# Altium schematic sheet ClockBase.SchDoc
size A4; SheetNumber: 1; SheetTotal: 1
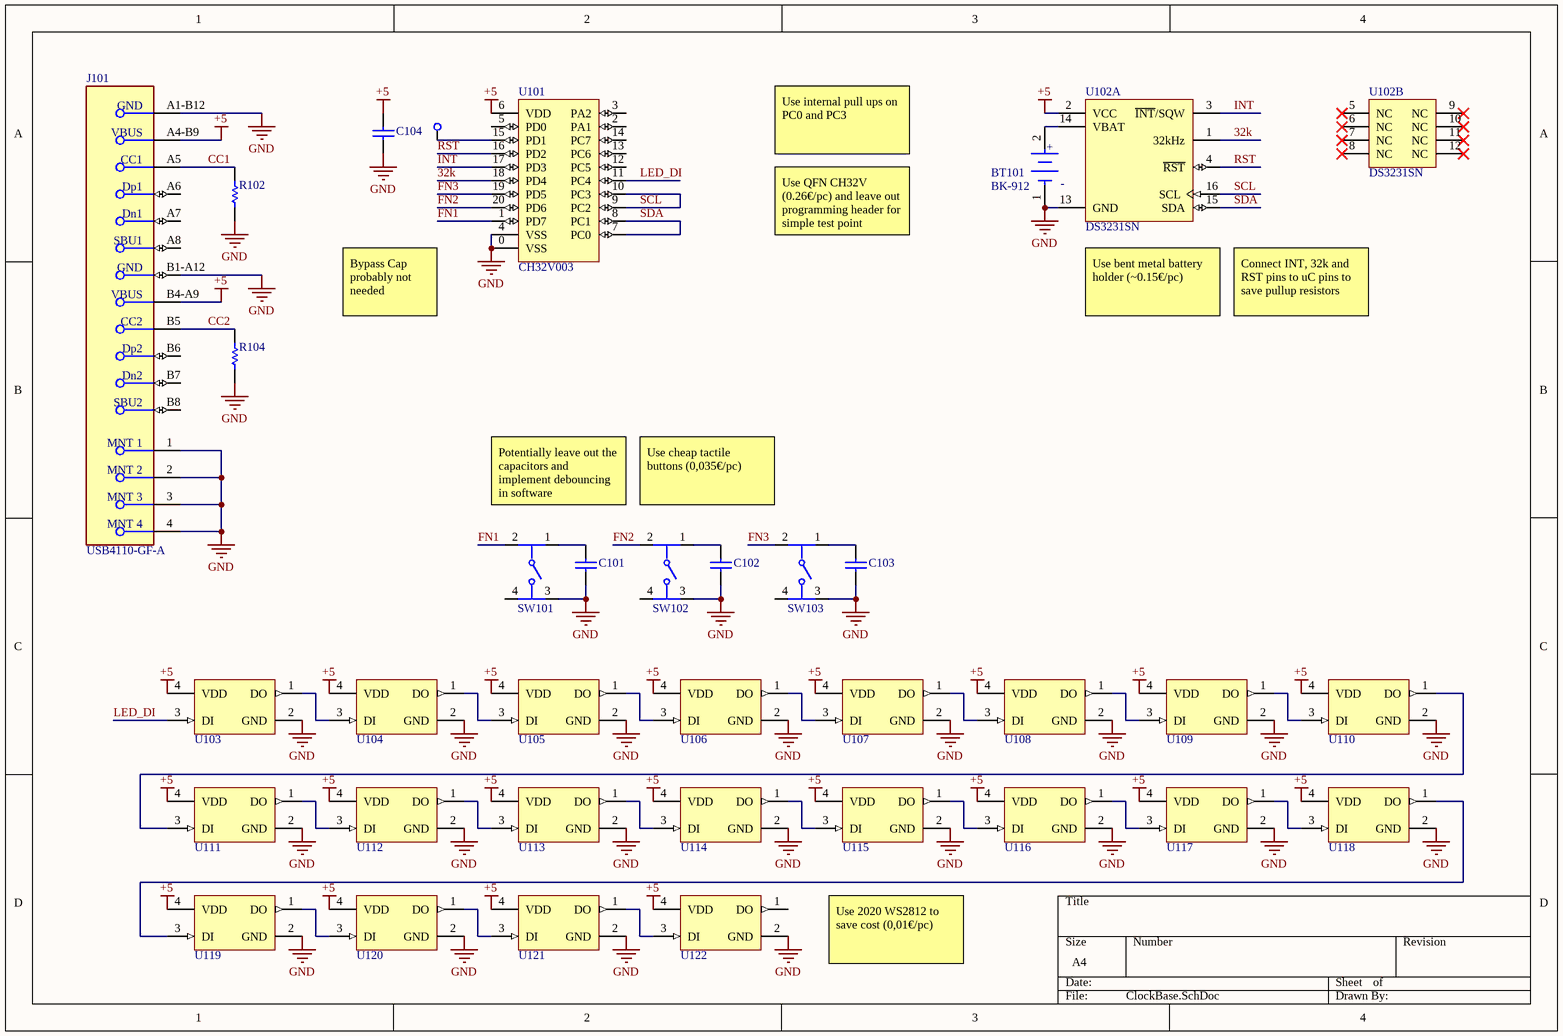
[diagram p0: ClockBase.SchDoc]

## Parts
BT101  BK-912  [FP-BK-912-MFG]
C101  Capacitor  [CAPC1608X09N]  (value not drawn)
C102  Capacitor  [CAPC1608X09N]  (value not drawn)
C103  Capacitor  [CAPC1608X09N]  (value not drawn)
C104  Capacitor  [CAPC1608X09N]  (value not drawn)
J101  USB4110-GF-A  [FP-USB4110-GF-A-MFG]
R102  Resistor  [RESC1608X06N]  (value not drawn)
R104  Resistor  [RESC1608X06N]  (value not drawn)
SW101  PTS526SK15SMTR2LFS  [FP-PTS526SK15SMTR2LFS-MFG]  (value not drawn)
SW102  PTS526SK15SMTR2LFS  [FP-PTS526SK15SMTR2LFS-MFG]  (value not drawn)
SW103  PTS526SK15SMTR2LFS  [FP-PTS526SK15SMTR2LFS-MFG]  (value not drawn)
TP101  TestPoint  [TestPoint]  (value not drawn)
U101  CH32V003  [QFN40P300X300X75_HS-21N]
U102  DS3231SN  [SOP127P1030X265-16N]  (parts A,B of 2)
U103  NOT COMPATIBLE WITH WS2812B  [LED_WS2812-2020]  (value not drawn)
U104  NOT COMPATIBLE WITH WS2812B  [LED_WS2812-2020]  (value not drawn)
U105  NOT COMPATIBLE WITH WS2812B  [LED_WS2812-2020]  (value not drawn)
U106  NOT COMPATIBLE WITH WS2812B  [LED_WS2812-2020]  (value not drawn)
U107  NOT COMPATIBLE WITH WS2812B  [LED_WS2812-2020]  (value not drawn)
U108  NOT COMPATIBLE WITH WS2812B  [LED_WS2812-2020]  (value not drawn)
U109  NOT COMPATIBLE WITH WS2812B  [LED_WS2812-2020]  (value not drawn)
U110  NOT COMPATIBLE WITH WS2812B  [LED_WS2812-2020]  (value not drawn)
U111  NOT COMPATIBLE WITH WS2812B  [LED_WS2812-2020]  (value not drawn)
U112  NOT COMPATIBLE WITH WS2812B  [LED_WS2812-2020]  (value not drawn)
U113  NOT COMPATIBLE WITH WS2812B  [LED_WS2812-2020]  (value not drawn)
U114  NOT COMPATIBLE WITH WS2812B  [LED_WS2812-2020]  (value not drawn)
U115  NOT COMPATIBLE WITH WS2812B  [LED_WS2812-2020]  (value not drawn)
U116  NOT COMPATIBLE WITH WS2812B  [LED_WS2812-2020]  (value not drawn)
U117  NOT COMPATIBLE WITH WS2812B  [LED_WS2812-2020]  (value not drawn)
U118  NOT COMPATIBLE WITH WS2812B  [LED_WS2812-2020]  (value not drawn)
U119  NOT COMPATIBLE WITH WS2812B  [LED_WS2812-2020]  (value not drawn)
U120  NOT COMPATIBLE WITH WS2812B  [LED_WS2812-2020]  (value not drawn)
U121  NOT COMPATIBLE WITH WS2812B  [LED_WS2812-2020]  (value not drawn)
U122  NOT COMPATIBLE WITH WS2812B  [LED_WS2812-2020]  (value not drawn)

## Nets
+5: C104.2 J101.A4-B9(VBUS) J101.B4-A9(VBUS) U101.6(VDD) U102.2(VCC) U103.4(VDD) U104.4(VDD) U105.4(VDD) U106.4(VDD) U107.4(VDD) U108.4(VDD) U109.4(VDD) U110.4(VDD) U111.4(VDD) U112.4(VDD) U113.4(VDD) U114.4(VDD) U115.4(VDD) U116.4(VDD) U117.4(VDD) U118.4(VDD) U119.4(VDD) U120.4(VDD) U121.4(VDD) U122.4(VDD)
GND: BT101.1(C) C101.1 C102.1 C103.1 C104.1 J101.1(MNT_1) J101.2(MNT_2) J101.3(MNT_3) J101.4(MNT_4) J101.A1-B12(GND) J101.B1-A12(GND) R102.1 R104.1 SW101.3 SW102.3 SW103.3 U101.0(VSS) U101.4(VSS) U102.13(GND) U103.2(GND) U104.2(GND) U105.2(GND) U106.2(GND) U107.2(GND) U108.2(GND) U109.2(GND) U110.2(GND) U111.2(GND) U112.2(GND) U113.2(GND) U114.2(GND) U115.2(GND) U116.2(GND) U117.2(GND) U118.2(GND) U119.2(GND) U120.2(GND) U121.2(GND) U122.2(GND)
32k: U101.18(PD4) U102.1(32kHz)
CC1: J101.A5(CC1) R102.2
CC2: J101.B5(CC2) R104.2
FN1: SW101.2 U101.1(PD7)
FN2: SW102.2 U101.20(PD6)
FN3: SW103.2 U101.19(PD5)
INT: U101.17(PD3) U102.3(~{INT}/SQW)
LED_DI: U101.11(PC4) U103.3(DI)
RST: U101.16(PD2) U102.4(~{RST})
SCL: U101.9(PC2) U101.10(PC3) U102.16(SCL)
SDA: U101.7(PC0) U101.8(PC1) U102.15(SDA)
NetBT101_2: BT101.2(A) U102.14(VBAT)
NetC101_2: C101.2 SW101.1
NetC102_2: C102.2 SW102.1
NetC103_2: C103.2 SW103.1
NetTP101_TP: TP101.TP U101.15(PD1)
NetU103_1: U103.1(DO) U104.3(DI)
NetU104_1: U104.1(DO) U105.3(DI)
NetU105_1: U105.1(DO) U106.3(DI)
NetU106_1: U106.1(DO) U107.3(DI)
NetU107_1: U107.1(DO) U108.3(DI)
NetU108_1: U108.1(DO) U109.3(DI)
NetU109_1: U109.1(DO) U110.3(DI)
NetU110_1: U110.1(DO) U111.3(DI)
NetU111_1: U111.1(DO) U112.3(DI)
NetU112_1: U112.1(DO) U113.3(DI)
NetU113_1: U113.1(DO) U114.3(DI)
NetU114_1: U114.1(DO) U115.3(DI)
NetU115_1: U115.1(DO) U116.3(DI)
NetU116_1: U116.1(DO) U117.3(DI)
NetU117_1: U117.1(DO) U118.3(DI)
NetU118_1: U118.1(DO) U119.3(DI)
NetU119_1: U119.1(DO) U120.3(DI)
NetU120_1: U120.1(DO) U121.3(DI)
NetU121_1: U121.1(DO) U122.3(DI)

Not connected (* = marked no-connect by the designer): J101 A6(Dp1) A7(Dn1) A8(SBU1) B6(Dp2) B7(Dn2) B8(SBU2); SW101 4; SW102 4; SW103 4; U101 2(PA1) 3(PA2) 5(PD0) 12(PC5) 13(PC6) 14(PC7); U102 5(NC)* 6(NC)* 7(NC)* 8(NC)* 9(NC)* 10(NC)* 11(NC)* 12(NC)*; U122 1(DO)

## Notes on the sheet
- Use internal pull ups on PC0 and PC3
- Use QFN CH32V (0.26€/pc) and leave out programming header for simple test point
- Bypass Cap probably not needed
- (near U102) Use bent metal battery holder (~0.15€/pc)
- Connect INT, 32k and RST pins to uC pins to save pullup resistors
- Potentially leave out the capacitors and implement debouncing in software
- Use cheap tactile buttons (0,035€/pc)
- Use 2020 WS2812 to save cost (0,01€/pc)
- (in symbol CMP-136216-000003-1) +; -

## Library data of the parts
BT101 = CMP-136216-000003-1: BATTERY RETAINER COIN 20MM SMD; Number of Cells: 1; Mount: Surface Mount; Termination: SMD/SMT; Package Quantity: 100; Case/Package: SMD/SMT
C101-C104 = C0603: Value: 1p; Voltage: *; Dielectric: *
J101 = CMP-245163-000002-1: CONN USB 2.0 TYPE-C R/A SMT; Manufacturer: GCT; Conn Orientation: Right Angle; Usb Standard: USB 2.0; Voltage Rating: 20V; Current Rating: 3/4.25/1.25/0.25A; Number Of Contacts: 16; Is Female: yes; Shielding: true; Standoff Height: 0.1mm; Octopart: https://octopart.com/usb4110-gf-a-gct-103941985; Temperature: -40°C to +85°C; RoHS: TRUE; Automotive: No; Contact Material: Gold,Nickel; Device Class L1: Connectors; Device Class L2: USB Connectors; Package: 0; Lead Free: Yes; ComponentLink2URL: https://gct.co/files/drawings/usb4110.pdf; Temperature Range High: +85°C; Temperature Range Low: -40°C; Height: 3.46mm; Manufacturer Part Number: USB4110-GF-A; ComponentLink2Description: Datasheet; Device Class L3: unset; Digikey Description: CONN USB 2.0 TYPE-C R/A SMT; Category: Conn
R102 R104 = R0603: Value: *
SW101-SW103 = CMP-10040-000013-1: TACT 5.2 X 5.2, 1.5 MM H, 260GF,; Manufacturer: C&K; Operating Force: 250gf; Throw Configuration: SPST-NO; Contact Current Rating: 50mA; Standoff Height: 0mm; Contact Resistance: 100mΩ; Voltage Rating Dc: 12V; Electromechanical Life: 200000Cycles; Device Class L3: Tactile Switches; Device Class L2: Switches; Temperature: -20°C to +70°C; Temperature Range Low: -20°C; Package: PTS526SK15SMTR2LFS; Temperature Range High: +70°C; ComponentLink2Description: Datasheet; Device Class L1: Electromechanical; Height: 1.65mm; Digikey Description: TACT 5.2 X 5.2, 1.5 MM H, 260GF,; Category: Switch; RoHS: TRUE; Automotive: No; Lead Free: Yes; Manufacturer Part Number: PTS526SK15SMTR2LFS; Octopart: https://octopart.com/pts526+sk15+smtr2+lfs-c%26k+components-100617999; ComponentLink2URL: https://www.ckswitches.com/media/2780/pts526.pdf
U101 = CH32V003F4U6: CH32V003 series is an industrial-grade general-purpose microcontroller designed based on QingKe RISC-V2A / core, which supports 48MHz system main frequency in the product function
U102 = DS3231SN: Extremely Accurate I2C-Integrated Real-Time Clock/TCXO/Crystal, 16-Pin SO, -40 to 85 degC, Reel; PackageReference: W16-H2; DatasheetVersion: Rev 8, Jul-2010; ComponentLink1URL: http://www.maxim-ic.com; ComponentLink1Description: Manufacturer URL; ComponentLink2URL: http://datasheets.maxim-ic.com/en/ds/DS3231.pdf; ComponentLink3Description: Package Specification; ComponentLink2Description: Datasheet; Code_JEDEC: MS-013-AA; PackageVersion: revD, 2010; Code_IPC: SOIC127P1030-16; ComponentLink3URL: http://pdfserv.maxim-ic.com/package_dwgs/21-0042.PDF; PackageDescription: 16-Pin Small-Outline IC, Wide (0.3in), 1.27 mm Pitch, SOIC (W)
U103-U122 = WS2812_2018: Adressable RGB LED